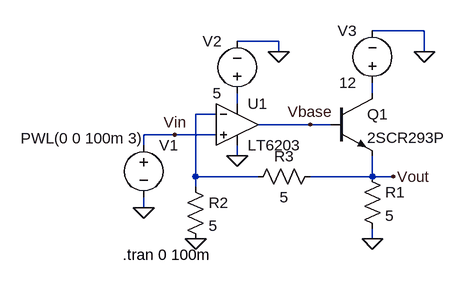
[diagram p0: schematic CurrentBuffer.asc]
CurrentBuffer.asc, the LTspice schematic file:
Version 4
SHEET 1 880 680
WIRE 448 0 368 0
WIRE 224 16 160 16
WIRE 224 32 224 16
WIRE 448 32 448 0
WIRE 368 96 368 80
WIRE 160 112 160 96
WIRE 128 128 96 128
WIRE 272 144 192 144
WIRE 304 144 272 144
WIRE 64 160 16 160
WIRE 128 160 64 160
WIRE 16 176 16 160
WIRE 160 192 160 176
WIRE 96 224 96 128
WIRE 192 224 96 224
WIRE 368 224 368 192
WIRE 368 224 272 224
WIRE 400 224 368 224
WIRE 96 240 96 224
WIRE 16 272 16 256
WIRE 368 320 368 304
FLAG 368 320 0
FLAG 16 272 0
FLAG 160 192 0
FLAG 224 32 0
FLAG 448 32 0
FLAG 64 160 Vin
FLAG 272 144 Vbase
FLAG 400 224 Vout
FLAG 96 320 0
SYMBOL Opamps\\LT6203 160 144 R0
SYMATTR InstName U1
SYMBOL npn 304 96 R0
SYMATTR InstName Q1
SYMATTR Value 2SCR293P
SYMBOL voltage 16 160 R0
WINDOW 123 0 0 Left 2
WINDOW 39 0 0 Left 2
WINDOW 3 -189 5 Left 2
SYMATTR InstName V1
SYMATTR Value PWL(0 0 100m 3)
SYMBOL res 352 208 R0
SYMATTR InstName R1
SYMATTR Value 5
SYMBOL voltage 160 112 R180
WINDOW 0 24 96 Left 2
WINDOW 3 24 16 Left 2
SYMATTR InstName V2
SYMATTR Value 5
SYMBOL voltage 368 96 R180
WINDOW 0 24 96 Left 2
WINDOW 3 24 16 Left 2
SYMATTR InstName V3
SYMATTR Value 12
SYMBOL res 80 224 R0
SYMATTR InstName R2
SYMATTR Value 5
SYMBOL res 288 208 R90
WINDOW 0 0 56 VBottom 2
WINDOW 3 32 56 VTop 2
SYMATTR InstName R3
SYMATTR Value 5
TEXT -16 344 Left 2 !.tran 0 100m

The netlist it stands for:
* CurrentBuffer.asc
* U1: LT6203 (symbol Opamps\LT6203 not available, pins judged from their places): In+=Vin In-=N003 V+=N002 V-=0 OUT=Vbase
Q1 N001 Vbase Vout 0 2SCR293P
V1 Vin 0 PWL(0 0 100m 3)
R1 Vout 0 5
V2 N002 0 5
V3 N001 0 12
R2 N003 0 5
R3 Vout N003 5
.model NPN NPN
.model PNP PNP
.lib standard.bjt
.tran 0 100m
.backanno
.end